# Altium schematic sheet PSU5V-400mA.SchDoc: 9-16V to 5V - 400mA
size A3; DrawnBy: Tom Benedetti (Based on Jonn Dillon); DocumentNumber: N/A; Revision: 02; SheetNumber: 1; SheetTotal: 1; Version: 01; Project: QUTMS Common Altium Schematics; PageSetup: Record=PageOptions|CenterHorizontal=True|CenterVertical=True|PrintScale=0.97|XCorrection=1.00|YCorrection=1.00|PrintKind=0|BorderSize=5000000|LeftOffset=0|BottomOffset=0|Orientation=2|PaperLength=1000|PaperWidth=1000|Scale=100|PaperSource=7|PrintQuality=-4|MediaType=1|DitherType=10|PaperKind=A4|PrintScaleMode=1
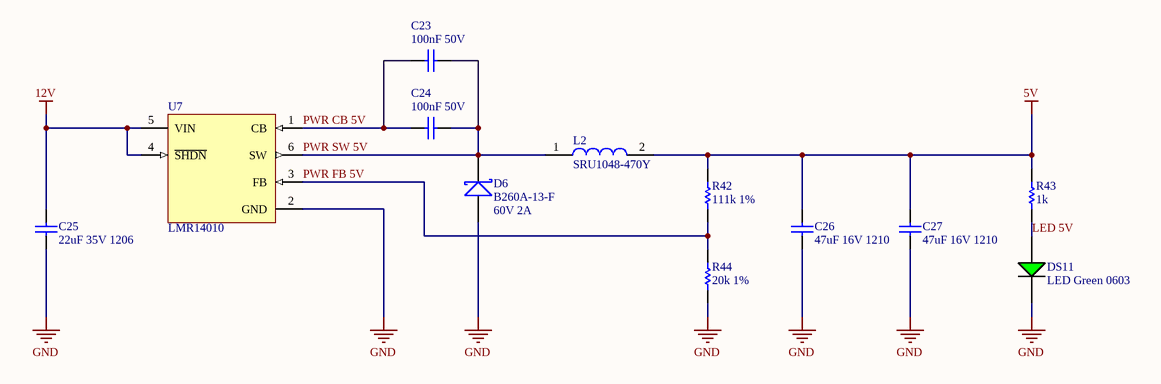
[diagram p0: PSU5V-400mA.SchDoc]

## Parts
C23  100nF 50V  [Cap_Ceramic_0603]
C24  100nF 50V  [Cap_Ceramic_0603]
C25  22uF 35V 1206  [Cap_Ceramic_1206]
C26  47uF 16V 1210  [Cap_Ceramic_1210]
C27  47uF 16V 1210  [Cap_Ceramic_1210]
D6  B260A-13-F  [SMA]
DS11  LED Green 0603  [LED GREEN 0603]
L2  SRU1048-470Y  [SRU1048]
R42  111k 1%  [Res_ThinFilm_0603]
R43  1k  [Res_ThinFilm_0603]
R44  20k 1%  [Res_ThinFilm_0603]
U7  LMR14010  [LMR14010]

## Nets
5V: C26.2 C27.2 L2.2 R42.2 R43.2
12V: C25.2 U7.4(~{SHDN}) U7.5(VIN)
GND: C25.1 C26.1 C27.1 D6.A DS11.2(C) R44.1 U7.2(GND)
LED 5V: DS11.1(A) R43.1
PWR CB 5V: C23.1 C24.1 U7.1(CB)
PWR FB 5V: R42.1 R44.2 U7.3(FB)
PWR SW 5V: C23.2 C24.2 D6.K L2.1 U7.6(SW)

## Notes on the sheet
- (near D6) 60V 2A
- Revision History:
- Sheet Title:
- Rev
- Date
- Description
- Project:
- Size:
- Drawn By:
- A3
- Number:
- Revision:
- Sheet
- Version:
- of
- QUT Motorsport
- O-120, Gardens Point
- 2 George Street
- Brisbane, QLD 4000
- Australia
- Print Date:
- Print Time:
- File Name:

## Library data of the parts
C23 C24 = 100nF 50V 5% X7R 0603: Capacitor, Ceramic, SMD, 100nF, 50V, 5%, X7R, 0603
C25 = 22uF 35V 10% X7R 1206: Capacitor, Ceramic, SMD, 22uF, 35V, 10%, X7R, 1206
C26 C27 = 47uF 16V 10% X7R 1210: Capacitor, Ceramic, SMD, 47uF, 16V, 5%, X7R, 1210
D6 = B260A-13-F: Diode, Schottky Barrier Rectifier, 60 V, 2 A, B260A-13-F
L2 = SRU1048-470Y: Fixed Inductors 47uH 30% SMD 1048
R42 = 111k 1% 0603: Resistor, SMD, 111k, 0.1W, 5%, 0603
R43 = 1k 5% 0603: Resistor, SMD, 1k, 0.1W, 5%, 0603
R44 = 20k 1% 0603: Resistor, SMD, 20k, 0.1W, 1%, 0603